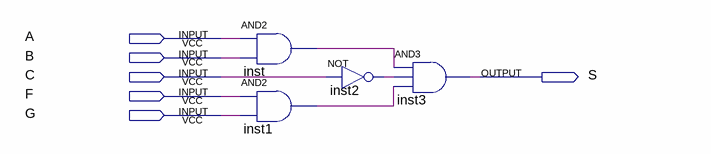
[diagram p0: schematic sheet]
// Quartus schematic Block13.bdf as structural Verilog: 4 symbols, 6 pins
module Block13 (
  input  A,
  input  B,
  input  C,
  input  F,
  input  G,
  output S
);

  wire inst1_out, inst2_out, inst_out;

  and inst (inst_out, A, B);
  and inst1 (inst1_out, F, G);
  not inst2 (inst2_out, C);
  and inst3 (S, inst_out, inst2_out, inst1_out);
endmodule
